# EAGLE design roomba (EAGLE 7.5.0)
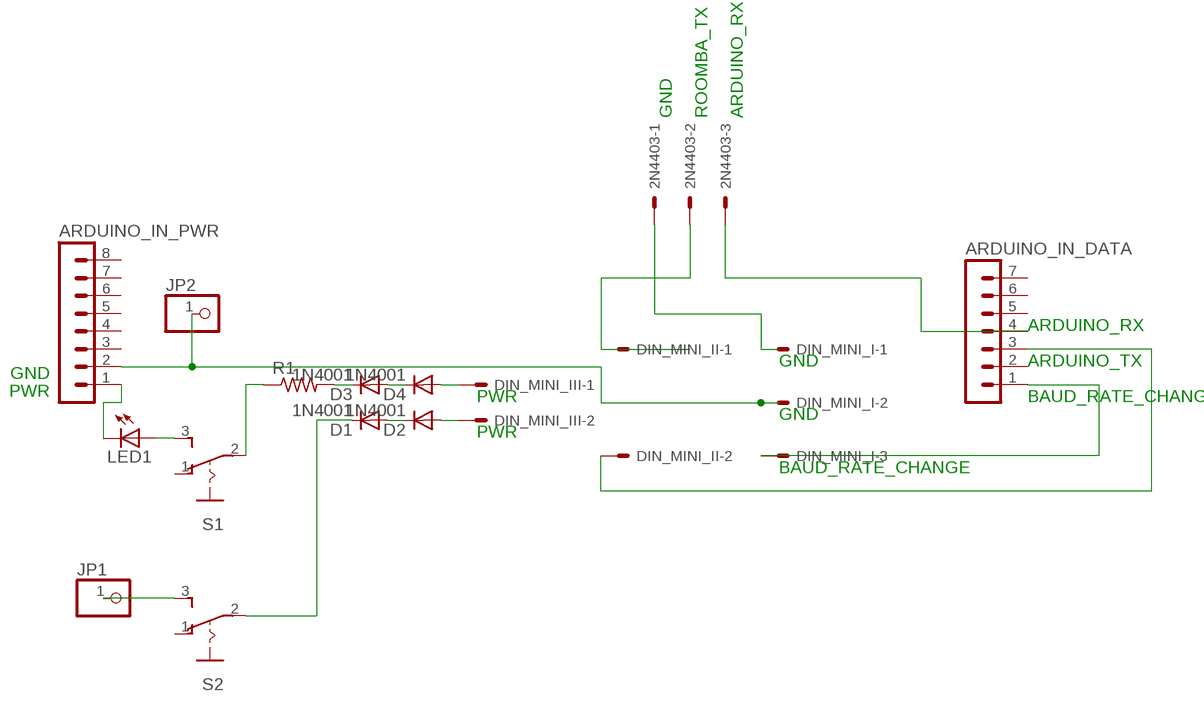
[diagram p0: schematic, sheet 1]

## Parts
2N4403  22-23-2031  [22-23-2031]
ARDUINO_IN_DATA  MA07-1  [MA07-1]
ARDUINO_IN_PWR  MA08-1  [MA08-1]
D1  1N4001  1N4004  [DO41-10]
D2  1N4001  1N4004  [DO41-10]
D3  1N4001  1N4004  [DO41-10]
D4  1N4001  1N4004  [DO41-10]
DIN_MINI_I  22-23-2031  [22-23-2031]
DIN_MINI_II  22-23-2021  [22-23-2021]
DIN_MINI_III  22-23-2021  [22-23-2021]
JP1  PINHD-1X1  [1X01]
JP2  PINHD-1X1  [1X01]
LED1  LED5MM  [LED5MM]
R1  R-US_0207/7  [0207/7]
S1  M251  [M251]
S2  M251  [M251]

## Nets
N$1: 2N4403.2 DIN_MINI_II.1
N$2: 2N4403.1 DIN_MINI_I.1
N$3: R1.1 S1.2(P)
N$4: D3.A D4.C
N$5: ARDUINO_IN_PWR.2 DIN_MINI_I.2 JP2.1
N$6: 2N4403.3 ARDUINO_IN_DATA.4
N$7: ARDUINO_IN_DATA.1 DIN_MINI_I.3
N$8: ARDUINO_IN_DATA.3 DIN_MINI_II.2
N$9: D4.A DIN_MINI_III.1
N$10: D2.A DIN_MINI_III.2
N$11: D1.A D2.C
N$12: LED1.A S1.3(S)
N$13: ARDUINO_IN_PWR.1 LED1.K(C)
N$14: D1.C S2.2(P)
N$15: D3.C R1.2
N$16: JP1.1 S2.3(S)
Unconnected: ARDUINO_IN_DATA.2 ARDUINO_IN_DATA.5 ARDUINO_IN_DATA.6 ARDUINO_IN_DATA.7 ARDUINO_IN_PWR.3 ARDUINO_IN_PWR.4 ARDUINO_IN_PWR.5 ARDUINO_IN_PWR.6 ARDUINO_IN_PWR.7 ARDUINO_IN_PWR.8 S1.1(O) S2.1(O)

## Notes on the sheet
- GND | ROOMBA_TX | ARDUINO_RX
- ARDUINO_RX
- GND | GND | ARDUINO_TX
- PWR
- PWR | BAUD_RATE_CHANGE
- GND
- PWR
- BAUD_RATE_CHANGE

## Library data of the parts
2N4403 DIN_MINI_I = con-molex:22-23-2031: .100" (2.54mm) Center Header - 3 Pin; MF: MOLEX; MPN: 22-23-2031; OC_FARNELL: 1462950; OC_NEWARK: 30C0862
ARDUINO_IN_DATA = con-lstb:MA07-1: PIN HEADER; OC_FARNELL: unknown; OC_NEWARK: unknown
ARDUINO_IN_PWR = con-lstb:MA08-1: PIN HEADER; OC_FARNELL: unknown; OC_NEWARK: unknown
D1-D4 = adafruit:1N4004: DIODE General purpose 1N400x type rectifier (With bigger pads) http://www.ladyada.net/library/pcb/eaglelibrary.html
DIN_MINI_II DIN_MINI_III = con-molex:22-23-2021: .100" (2.54mm) Center Header - 2 Pin; MF: MOLEX; MPN: 22-23-2021; OC_FARNELL: 1462926; OC_NEWARK: 25C3832
JP1 JP2 = adafruit:PINHD-1X1: Pin header 1x1 for 0.1" spacing With round pins
LED1 = adafruit:LED: LED OSRAM: - CHIPLED LG R971, LG N971, LY N971, LG Q971, LY Q971, LO R971, LY R971 LH N974, LH R974 LS Q976, LO Q976, LY Q976 LO Q996 - Hyper CHIPLED LW Q18S LB Q993, LB Q99A, LB R99A - SideLED LS A670, LO A670, LY A670, LG A670, LP A670 LB A673, LV A673, LT A673, LW A673 LH A674 LY A675 LS A676, LA A676, LO A676, LY A676, LW A676 LS A679, LY A679, LG A679 - Hyper Micro SIDELED® LS Y876, LA Y876, LO Y876, LY Y876 LT Y87S - SmartLED LW L88C, LW L88S LB L89C, LB L89S, LG L890 LS L89K, LO L89K, LY L89K LS L896, LA L896, LO L896, LY L896 - TOPLED LS T670, LO T670, LY T670, LG T670, LP T670 LSG T670, LSP T670, LSY T670, LOP T670, LYG T670 LG T671, LOG T671, LSG T671 LB T673, LV T673, LT T673, LW T673 LH T674 LS T676, LA T676, LO T676, LY T676, LB T676, LH T676, LSB T676, LW T676 LB T67C, LV T67C, LT T67C, LS T67K, LO T67K, LY T67K, LW E67C LS E67B, LA E67B, LO E67B, LY E67B, LB E67C, LV E67C, LT E67C LW T67C LS T679, LY T679, LG T679 LS T770, LO T770, LY T770, LG T770, LP T770 LB T773, LV T773, LT T773, LW T773 LH T774 LS E675, LA E675, LY E675, LS T675 LS T776, LA T776, LO T776, LY T776, LB T776 LHGB T686 LT T68C, LB T68C - Hyper Mini TOPLED® LB M676 - Mini TOPLED Santana® LG M470 LS M47K, LO M47K, LY M47K Source: http://www.osram.convergy.de/
R1 = adafruit:R-US_: RESISTOR, American symbol
S1 S2 = switch:M251: SLIDING SWITCH Mors, distributor Buerklin, 11G702

## Board
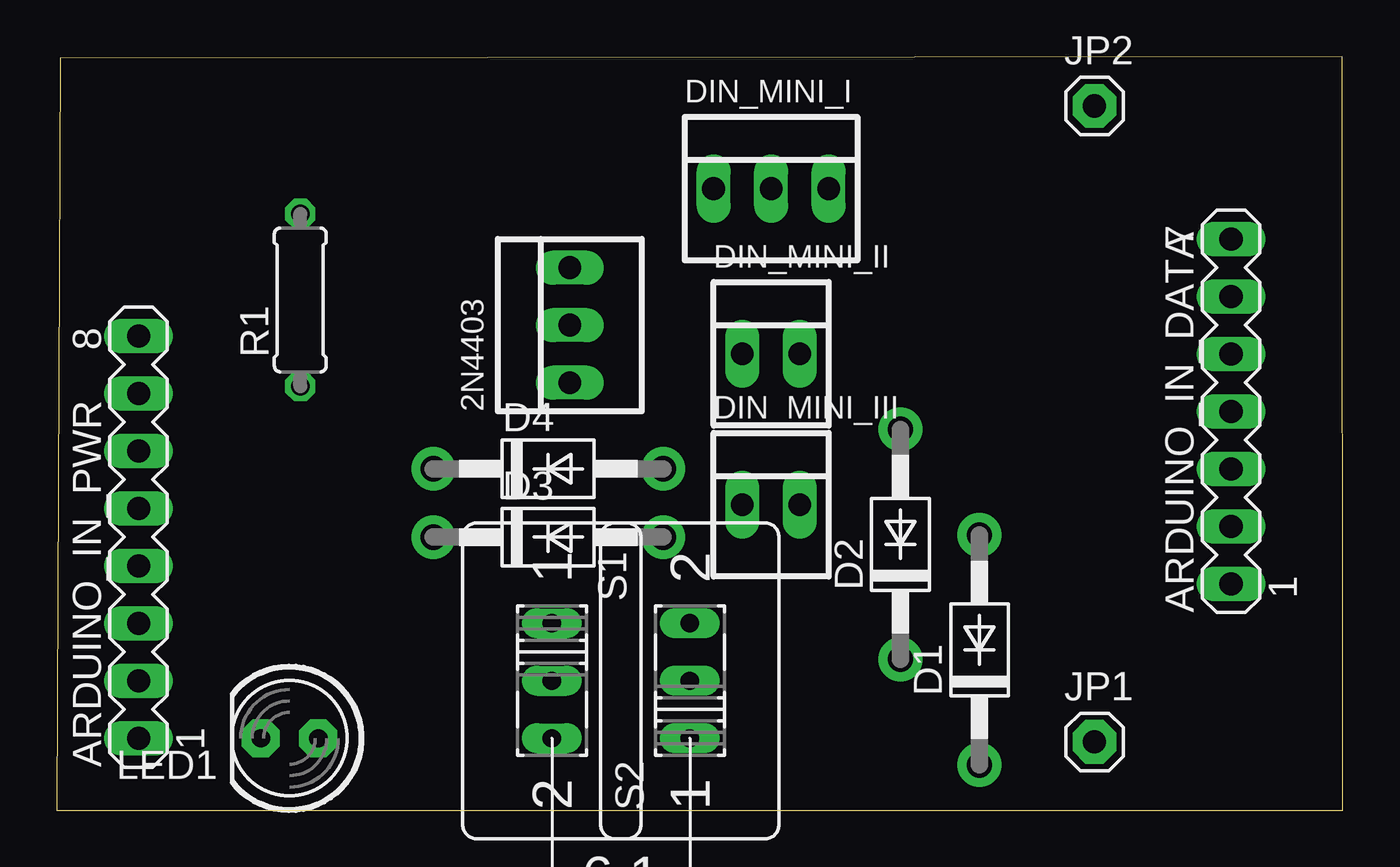
[diagram p1: board, top side]
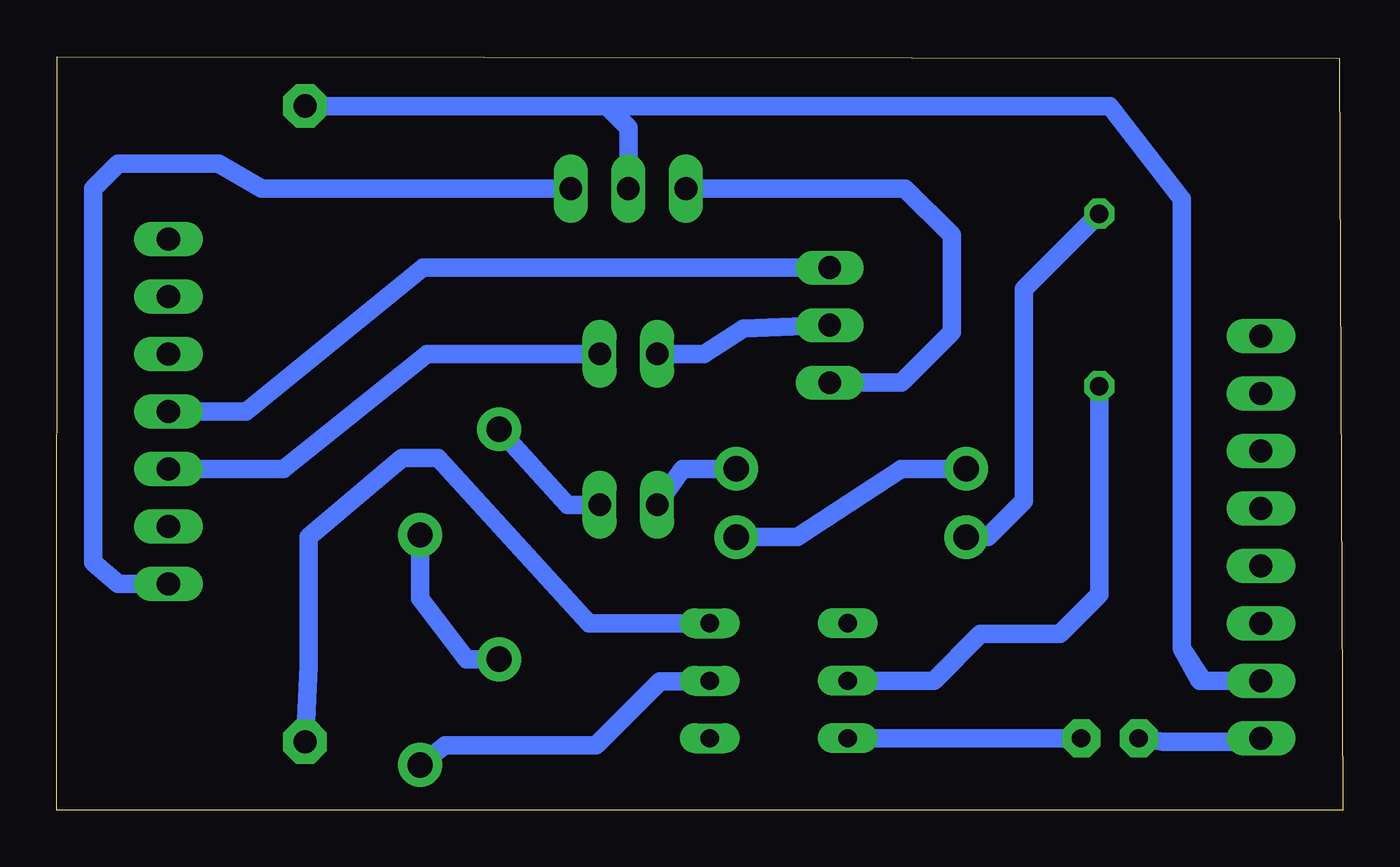
[diagram p2: board, bottom side, seen from below]

Size 56.82 x 33.3 mm. Coordinates in mm from the lower left corner, seen from the top.
Outline: 0,0 56.82,0 56.79,33.3 0.16,33.23 0,0
Copper layers (1*16): Top 0.035mm / dielectric 1.5mm / Bottom 0.035mm
Design rules "default": minimum track width 10mil, minimum drill 24mil, track to track 8mil, track to pad 8mil, pad to pad 8mil, via to via 8mil, smd to smd 8mil, copper to edge 40mil, drill to drill 8mil, minimum pad ring 10mil, minimum via ring 8mil, stop-mask expansion 4mil, vias tented up to drill 0mil, thermal gap 10mil

### Footprints (pad centres in the part's own frame; a part is rotated, then mirrored left to right if it is on the bottom)
22-23-2031 = drill 1 long: 1 -2.54,0; 2 0,0; 3 2.54,0
MA07-1 = drill 1.016 long: 1 -7.62,0; 2 -5.08,0; 3 -2.54,0; 4 0,0; 5 2.54,0; 6 5.08,0; 7 7.62,0
MA08-1 = drill 1.016 long: 1 -8.89,0; 2 -6.35,0; 3 -3.81,0; 4 -1.27,0; 5 1.27,0; 6 3.81,0; 7 6.35,0; 8 8.89,0
DO41-10 = drill 1.118 pad 1.93: A 5.08,0; C -5.08,0
22-23-2021 = drill 1 long: 1 -1.27,0; 2 1.27,0
1X01 = drill 1.016 pad 1.93 octagon: 1 0,0
LED5MM = drill 0.813 pad 1.676 octagon: A -1.27,0; K 1.27,0
0207/7 = drill 0.813 octagon: 1 -3.81,0; 2 3.81,0
M251 = drill 0.813 long: 1 -2.54,0; 2 0,0; 3 2.54,0

### Placement (x,y rotation side)
2N4403  22.67,21.43 90 top
ARDUINO_IN_DATA  51.88,17.62 90 top
ARDUINO_IN_PWR  3.62,12.06 90 top
D1  40.77,7.08 90 top
D2  37.27,11.75 90 top
D3  21.72,12.06 0 top
D4  21.72,15.08 0 top
DIN_MINI_I  31.56,27.46 0 top
DIN_MINI_II  31.56,20.16 0 top
DIN_MINI_III  31.56,13.49 0 top
JP1  45.85,3.02 0 top
JP2  45.85,31.11 0 top
LED1  10.29,3.17 180 top
R1  10.76,22.54 90 top
S1  21.88,5.71 270 top
S2  27.97,5.71 90 top

### Tracks (layer width: path | path; a pad name or v marks a point on that pad's centre or on a via)
N$1
  Bottom 0.813: 2N4403.2 26.48,21.27 28.23,20.16 DIN_MINI_II.1
N$2
  Bottom 0.813: DIN_MINI_I.1 19.34,27.46 17.27,25.4 17.27,21.11 19.49,18.89 2N4403.1
N$3
  Bottom 0.813: S1.2 18.07,5.71 16,7.78 12.51,7.78 10.76,9.53 R1.1
N$4
  Bottom 0.813: D4.C 19.49,15.08 24.1,12.06 D3.A
N$5
  Bottom 0.813: 32.51,31.11 10.29,31.11 7.11,26.99 7.11,7.14 | 32.51,31.11 JP2.1 | ARDUINO_IN_PWR.2 6.16,5.71 7.11,7.14 | 6.32,5.71 7.11,7.14 | DIN_MINI_I.2 31.56,30.16 32.51,31.11
N$6
  Bottom 0.813: 2N4403.3 40.64,23.97 48.45,17.62 ARDUINO_IN_DATA.4
N$7
  Bottom 0.813: ARDUINO_IN_DATA.1 54.1,10 55.21,10.95 55.21,27.46 54.1,28.57 49.66,28.57 47.75,27.46 DIN_MINI_I.3
N$8
  Bottom 0.813: DIN_MINI_II.2 40.45,20.16 46.8,15.08 ARDUINO_IN_DATA.3
N$9
  Bottom 0.813: D4.A 29.18,15.08 DIN_MINI_III.1
N$10
  Bottom 0.813: DIN_MINI_III.2 34.26,13.49 D2.A
N$11
  Bottom 0.813: D2.C 38.7,6.67 40.77,9.37 D1.A
N$12
  Bottom 0.813: S1.3 LED1.A
N$13
  Bottom 0.813: ARDUINO_IN_PWR.1 3.78,3.02 7.91,3.02 LED1.K
N$14
  Bottom 0.813: S2.2 28.07,5.68 30.16,5.68 32.99,2.86 39.66,2.86 D1.C
N$15
  Bottom 0.813: D3.C 15.68,12.06 14.1,13.65 14.1,23.02 R1.2
N$16
  Bottom 0.813: S2.3 33.31,8.26 39.97,15.56 41.56,15.56 45.69,12.06 45.69,6.35 JP1.1